# EAGLE design xo106-pth (EAGLE 7.7.0)
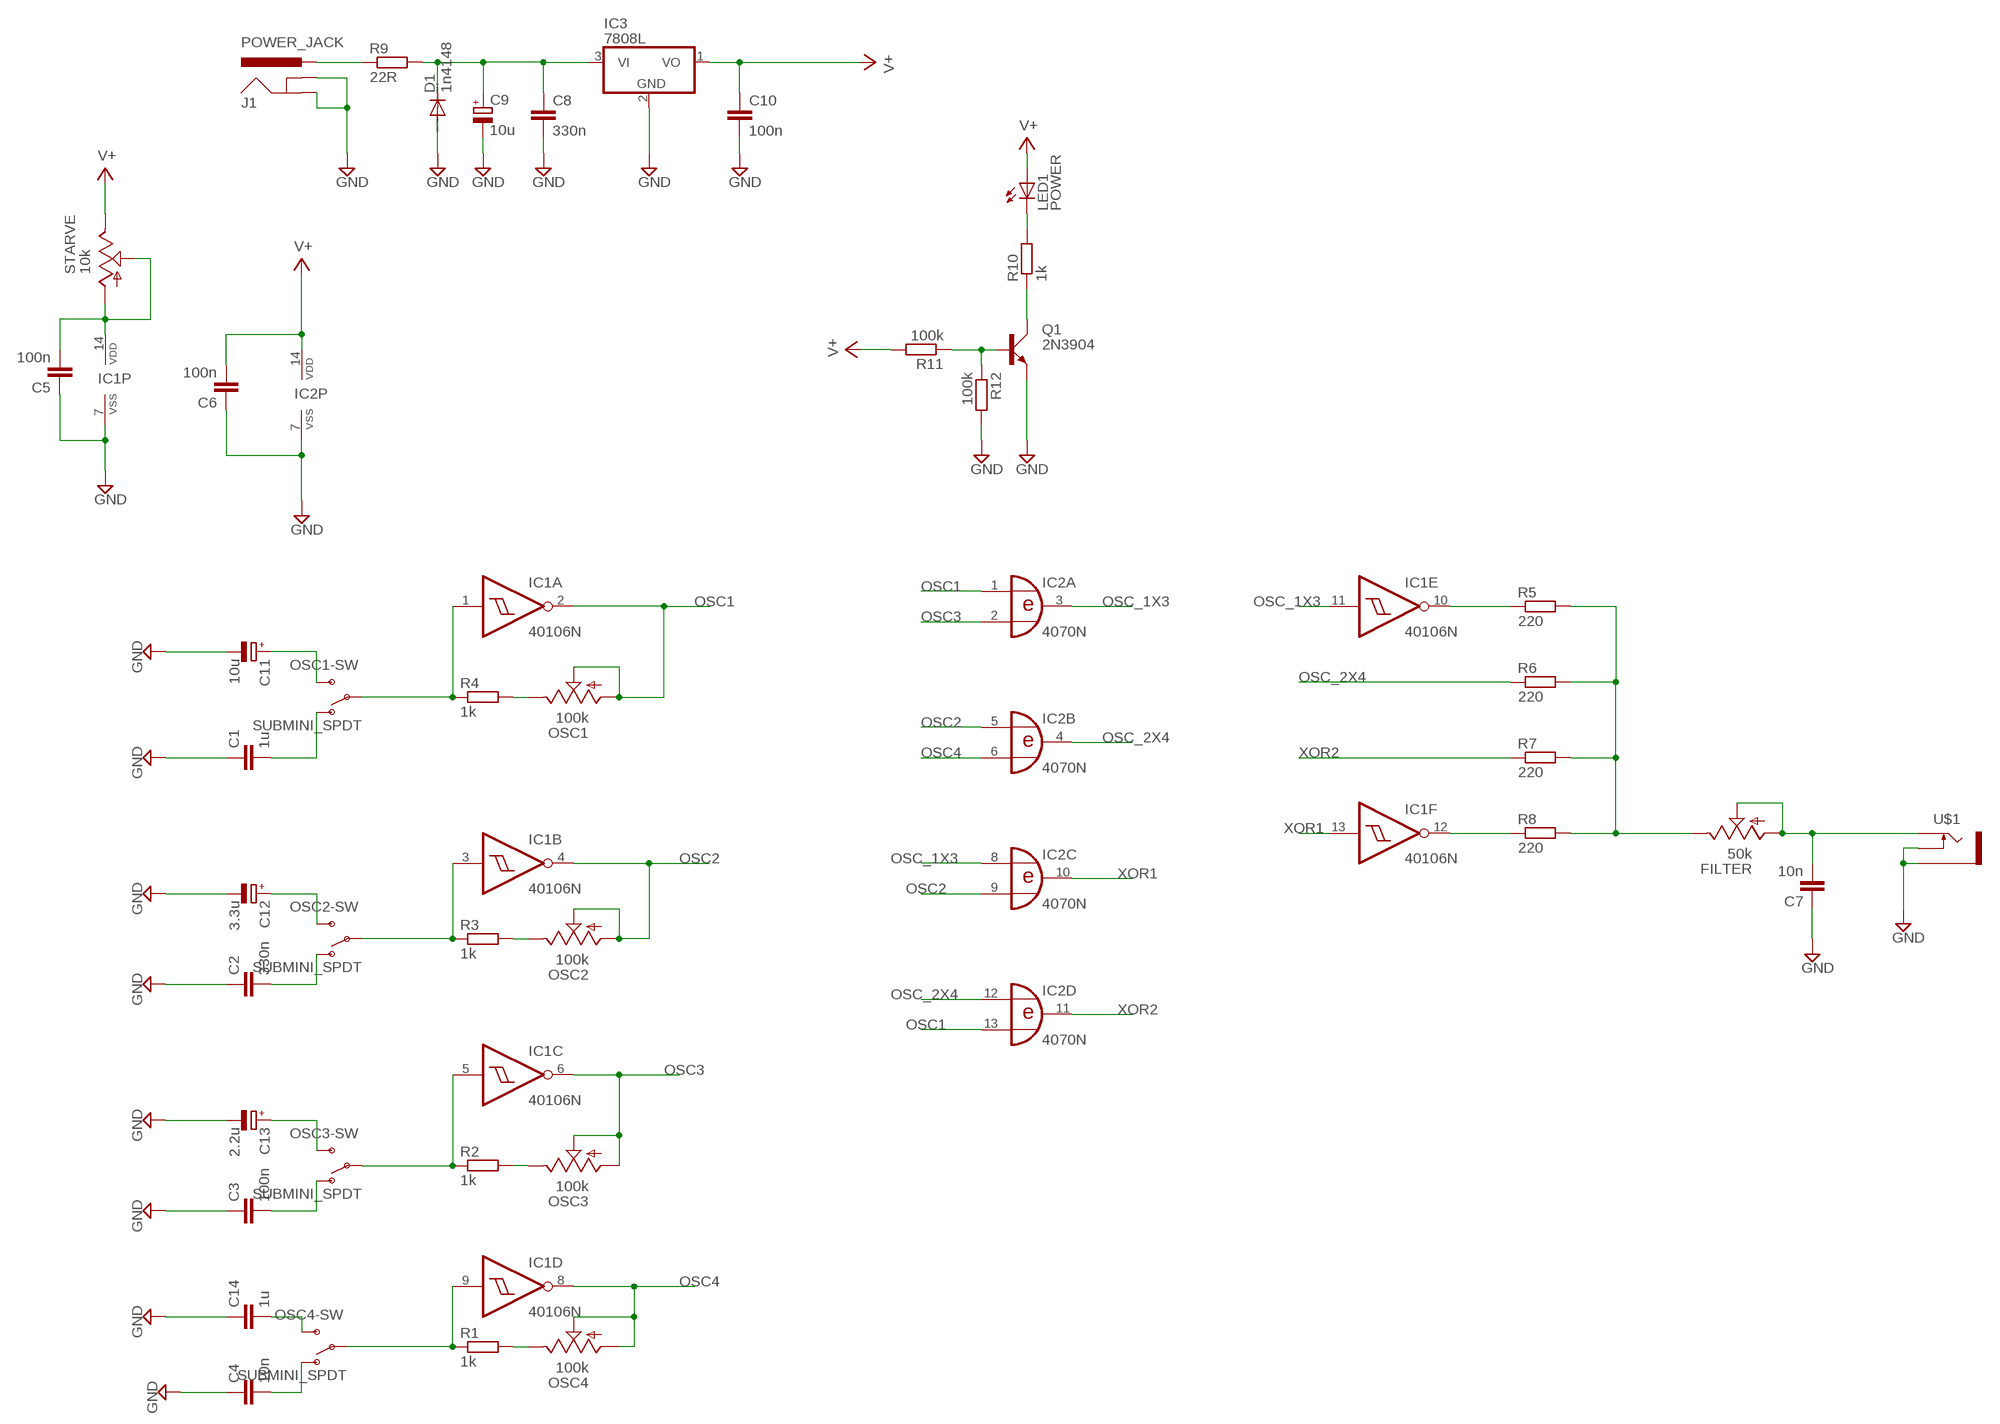
[diagram p0: schematic, sheet 1]

## Parts
C1  1u  C-EU050-025X075  [C050-025X075]
C2  330n  C-EU050-025X075  [C050-025X075]
C3  100n  C-EU050-025X075  [C050-025X075]
C4  10n  C-EU050-025X075  [C050-025X075]
C5  100n  C-EU025-025X050  [C025-025X050]
C6  100n  C-EU025-025X050  [C025-025X050]
C7  10n  C-EU050-025X075  [C050-025X075]
C8  330n  C-EU025-025X050  [C025-025X050]
C9  10u  CPOL-EUE2.5-5  [E2,5-5]
C10  100n  C-EU025-025X050  [C025-025X050]
C11  10u  CPOL-EUE2.5-5  [E2,5-5]
C12  3.3u  CPOL-EUE2.5-5  [E2,5-5]
C13  2.2u  CPOL-EUE2.5-5  [E2,5-5]
C14  1u  C-EU050-025X075  [C050-025X075]
D1  1n4148  DIODE-D-2.5  [D-2.5]
FILTER  50k  9MM_SNAP-IN_POT_  [9MM_SNAP-IN_POT]
IC1  40106N  [DIL14]
IC2  4070N  [DIL14]
IC3  7808L  [TO92]
J1  POWER_JACK  [POWER_JACK_PTH]
LED1  POWER  LED3MM  [LED3MM]
OSC1  100k  9MM_SNAP-IN_POT_  [9MM_SNAP-IN_POT]
OSC1-SW  SUBMINI_SPDT  [SUBMINI_TOGGLE]
OSC2  100k  9MM_SNAP-IN_POT_  [9MM_SNAP-IN_POT]
OSC2-SW  SUBMINI_SPDT  [SUBMINI_TOGGLE]
OSC3  100k  9MM_SNAP-IN_POT_  [9MM_SNAP-IN_POT]
OSC3-SW  SUBMINI_SPDT  [SUBMINI_TOGGLE]
OSC4  100k  9MM_SNAP-IN_POT_  [9MM_SNAP-IN_POT]
OSC4-SW  SUBMINI_SPDT  [SUBMINI_TOGGLE]
Q1  2N3904  [TO92D]
R1  1k  R-EU_0207/2V  [0207/2V]
R2  1k  R-EU_0207/2V  [0207/2V]
R3  1k  R-EU_0207/2V  [0207/2V]
R4  1k  R-EU_0207/2V  [0207/2V]
R5  220  R-EU_0207/2V  [0207/2V]
R6  220  R-EU_0207/2V  [0207/2V]
R7  220  R-EU_0207/2V  [0207/2V]
R8  220  R-EU_0207/2V  [0207/2V]
R9  22R  R-EU_0207/2V  [0207/2V]
R10  1k  R-EU_0207/2V  [0207/2V]
R11  100k  R-EU_0207/2V  [0207/2V]
R12  100k  R-EU_0207/2V  [0207/2V]
STARVE  10k  9MM_SNAP-IN_POT_  [9MM_SNAP-IN_POT]
U$1  PJ302M  [PJ302M]

## Nets
GND: C1.1 C2.1 C3.1 C4.1 C5.1 C6.1 C7.1 C8.2 C9.- C10.2 C11.- C12.- C13.- C14.1 D1.A IC1.7(P:VSS) IC2.7(P:VSS) IC3.2(GND) J1.GND J1.GNDBREAK Q1.E R12.2 U$1.GND(SLEEVE) U$1.SW(SWITCH)
N$1: IC1.3(B:I) OSC2-SW.COM(COMMON) R3.1
N$2: IC1.5(C:I) OSC3-SW.COM(COMMON) R2.1
N$3: IC1.1(A:I) OSC1-SW.COM(COMMON) R4.1
N$4: OSC1.3(E) R4.2
N$5: FILTER.3(E) R5.2 R6.2 R7.2 R8.2
N$6: OSC2.3(E) R3.2
N$7: C7.2 FILTER.1(A) FILTER.2(S) U$1.TIP
N$8: IC1.10(E:O) R5.1
N$9: OSC3.3(E) R2.2
N$10: IC1.9(D:I) OSC4-SW.COM(COMMON) R1.1
N$11: OSC4.3(E) R1.2
N$12: IC1.12(F:O) R8.1
N$13: C5.2 IC1.14(P:VDD) STARVE.1(A) STARVE.2(S)
N$14: C8.1 C9.+ D1.C IC3.3(VI) R9.2
N$15: C11.+ OSC1-SW.3(S)
N$16: C1.2 OSC1-SW.1(O)
N$17: Q1.B R11.1 R12.1
N$18: Q1.C R10.1
N$19: C12.+ OSC2-SW.3(S)
N$20: J1.PWR R9.1
N$21: C2.2 OSC2-SW.1(O)
N$22: LED1.K(C) R10.2
N$23: C13.+ OSC3-SW.3(S)
N$24: C3.2 OSC3-SW.1(O)
N$25: C4.2 OSC4-SW.1(O)
N$26: C14.2 OSC4-SW.3(S)
OSC1: IC1.2(A:O) IC2.1(A:I0) IC2.13(D:I1) OSC1.1(A) OSC1.2(S)
OSC2: IC1.4(B:O) IC2.5(B:I0) IC2.9(C:I1) OSC2.1(A) OSC2.2(S)
OSC3: IC1.6(C:O) IC2.2(A:I1) OSC3.1(A) OSC3.2(S)
OSC4: IC1.8(D:O) IC2.6(B:I1) OSC4.1(A) OSC4.2(S)
OSC_1X3: IC1.11(E:I) IC2.3(A:O) IC2.8(C:I0)
OSC_2X4: IC2.4(B:O) IC2.12(D:I0) R6.1
V+: C6.2 C10.1 IC2.14(P:VDD) IC3.1(VO) LED1.A R11.2 STARVE.3(E)
XOR1: IC1.13(F:I) IC2.10(C:O)
XOR2: IC2.11(D:O) R7.1

## Library data of the parts
C1-C8 C10 C14 = rcl:C-EU: CAPACITOR, European symbol
C9 C11-C13 = rcl:CPOL-EU: POLARIZED CAPACITOR, European symbol
D1 = diode:DIODE-: DIODE
FILTER OSC1-OSC4 STARVE = MusicThingModular:9MM_SNAP-IN_POT: 9mm vertical snap-in pot, Alpha / Panasonic style
IC1 = 40xx:40106: Hex SCHMITT TRIGGER
IC2 = 40xx:4070: Quad 2-input XOR
IC3 = linear:78*: Positive VOLTAGE REGULATOR Source: http://cache.national.com/ds/LM/LM78L05.pdf http://www.fairchildsemi.com/ds/LM/LM7805.pdf
J1 = SparkFun-Connectors:POWER_JACK: Power Jack Connector This is the standard 5.5mm barrel jack for power. The PTH is the most common, proven, reliable, footprint. The Slot footprint only works if the mill layer is transmitted to the PCB fab house so be warned. Here are the connectors we sell at SparkFun: DC Barrel Power Jack/Connector <https://www.sparkfun.com/products/119> (PRT-00119) DC Barrel Power Jack/Connector (SMD) <https://www.sparkfun.com/products/12748> (PRT-12748) DC Barrel Jack Adapter - Breadboard Compatible <https://www.sparkfun.com/products/10811> (PRT-10811) It is used on this SparkFun product (and many, many others): SparkFun RedBoard - Programmed with Arduino <https://www.sparkfun.com/products/12757> (DEV-12757) Also, if you need a mating power supply or connector, please check these out: Wall Adapter Power Supply - 9VDC 650mA <https://www.sparkfun.com/products/298> (TOL-00298) DC Barrel Jack Adapter - Male <https://www.sparkfun.com/products/10287> (PRT-10287); PROD_ID: CONN-08197
LED1 = led:LED: LED OSRAM: - CHIPLED LG R971, LG N971, LY N971, LG Q971, LY Q971, LO R971, LY R971 LH N974, LH R974 LS Q976, LO Q976, LY Q976 LO Q996 - Hyper CHIPLED LW Q18S LB Q993, LB Q99A, LB R99A - SideLED LS A670, LO A670, LY A670, LG A670, LP A670 LB A673, LV A673, LT A673, LW A673 LH A674 LY A675 LS A676, LA A676, LO A676, LY A676, LW A676 LS A679, LY A679, LG A679 - Hyper Micro SIDELED® LS Y876, LA Y876, LO Y876, LY Y876 LT Y87S - SmartLED LW L88C, LW L88S LB L89C, LB L89S, LG L890 LS L89K, LO L89K, LY L89K LS L896, LA L896, LO L896, LY L896 - TOPLED LS T670, LO T670, LY T670, LG T670, LP T670 LSG T670, LSP T670, LSY T670, LOP T670, LYG T670 LG T671, LOG T671, LSG T671 LB T673, LV T673, LT T673, LW T673 LH T674 LS T676, LA T676, LO T676, LY T676, LB T676, LH T676, LSB T676, LW T676 LB T67C, LV T67C, LT T67C, LS T67K, LO T67K, LY T67K, LW E67C LS E67B, LA E67B, LO E67B, LY E67B, LB E67C, LV E67C, LT E67C LW T67C LS T679, LY T679, LG T679 LS T770, LO T770, LY T770, LG T770, LP T770 LB T773, LV T773, LT T773, LW T773 LH T774 LS E675, LA E675, LY E675, LS T675 LS T776, LA T776, LO T776, LY T776, LB T776 LHGB T686 LT T68C, LB T68C - Hyper Mini TOPLED® LB M676 - Mini TOPLED Santana® LG M470 LS M47K, LO M47K, LY M47K Source: http://www.osram.convergy.de LUXEON: - LUMILED® LXK2-PW12-R00, LXK2-PW12-S00, LXK2-PW14-U00, LXK2-PW14-V00 LXK2-PM12-R00, LXK2-PM12-S00, LXK2-PM14-U00 LXK2-PE12-Q00, LXK2-PE12-R00, LXK2-PE12-S00, LXK2-PE14-T00, LXK2-PE14-U00 LXK2-PB12-K00, LXK2-PB12-L00, LXK2-PB12-M00, LXK2-PB14-N00, LXK2-PB14-P00, LXK2-PB14-Q00 LXK2-PR12-L00, LXK2-PR12-M00, LXK2-PR14-Q00, LXK2-PR14-R00 LXK2-PD12-Q00, LXK2-PD12-R00, LXK2-PD12-S00 LXK2-PH12-R00, LXK2-PH12-S00 LXK2-PL12-P00, LXK2-PL12-Q00, LXK2-PL12-R00 Source: www.luxeon.com KINGBRIGHT: KA-3528ASYC Source: www.kingbright.com
OSC1-SW OSC2-SW OSC3-SW OSC4-SW = MusicThingModular:SUBMINI_SPDT
Q1 = transistor-small-signal:2N3904: NPN TRANSISTOR
R1-R12 = rcl:R-EU_: RESISTOR, European symbol
U$1 = pj302m:PJ302M: PJ302M horizontal / right angled mount 3.5 mm jack socket

## Board
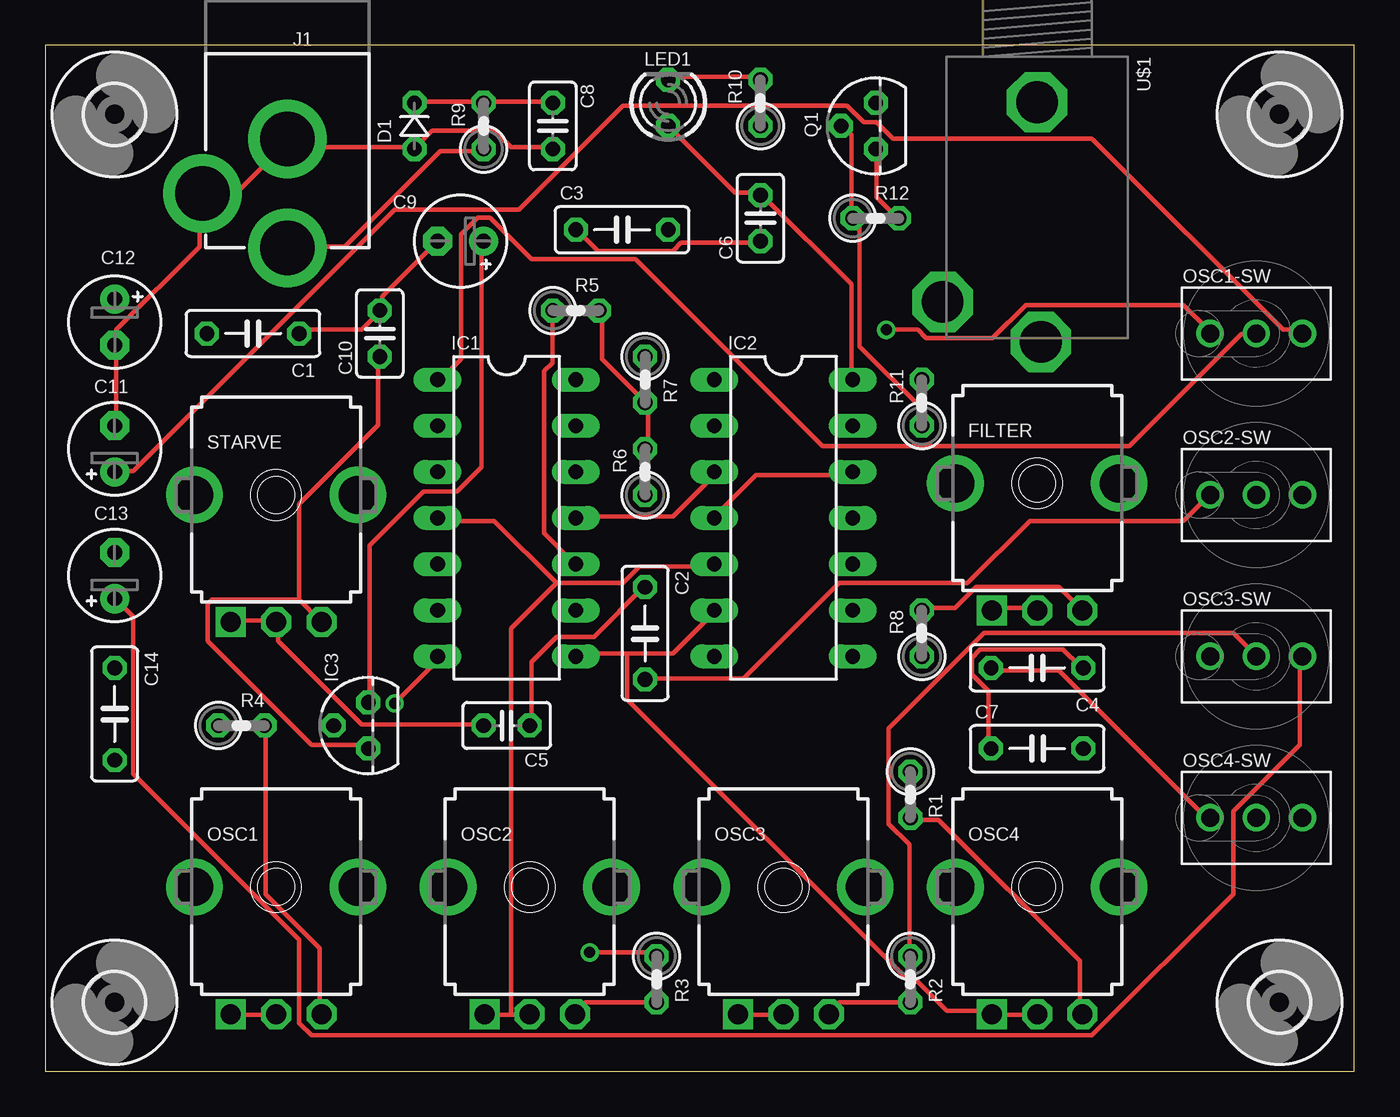
[diagram p1: board, top side]
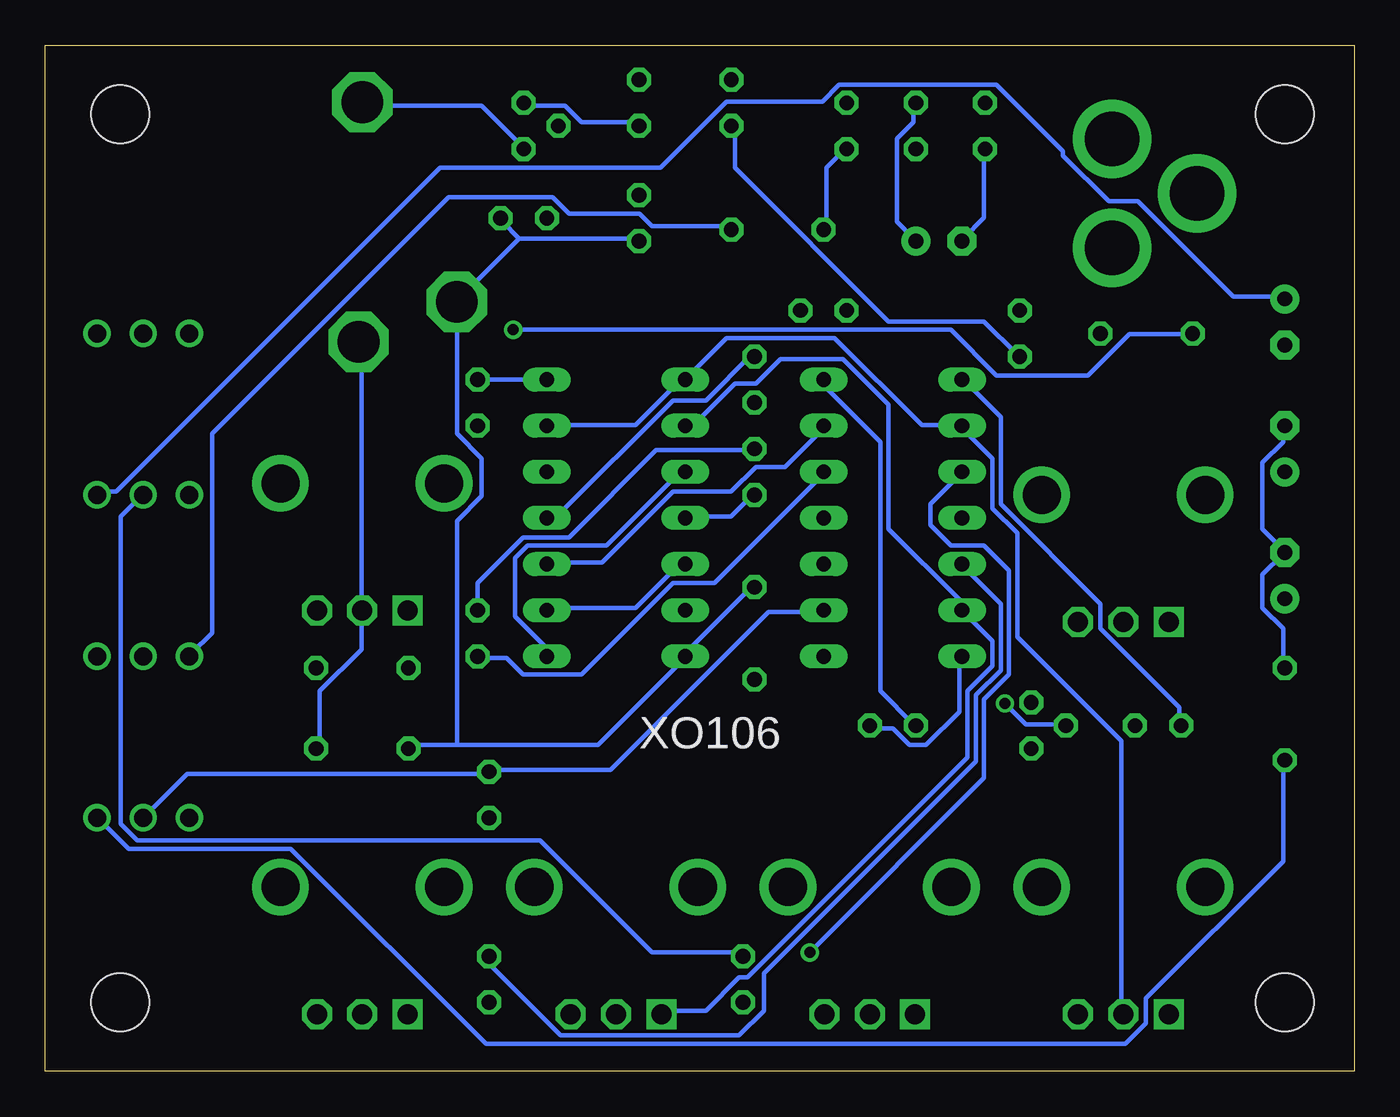
[diagram p2: board, bottom side, seen from below]

Size 72.06 x 56.51 mm. Coordinates in mm from the lower left corner, seen from the top.
Outline: 0,0 72.06,0 72.06,56.51 0,56.51 0,0
Copper layers (1*16): Top 0.035mm / dielectric 1.5mm / Bottom 0.035mm
Design rules "default": minimum track width 10mil, minimum drill 24mil, track to track 8mil, track to pad 8mil, pad to pad 8mil, via to via 8mil, smd to smd 8mil, copper to edge 40mil, drill to drill 8mil, minimum pad ring 10mil, minimum via ring 8mil, stop-mask expansion 4mil, vias tented up to drill 0mil, thermal gap 10mil

### Footprints (pad centres in the part's own frame; a part is rotated, then mirrored left to right if it is on the bottom)
C050-025X075 = drill 0.813 octagon: 1 -2.54,0; 2 2.54,0
C025-025X050 = drill 0.813 octagon: 1 -1.27,0; 2 1.27,0
E2,5-5 = drill 0.813 pad 1.6: + -1.27,0 | drill 0.813 pad 1.6 octagon: - 1.27,0
D-2.5 = drill 0.813 octagon: A 1.27,0; C -1.27,0
9MM_SNAP-IN_POT = drill 1.1 square: 1 -2.5,-7 | drill 1.1 octagon: 2 0,-7; 3 2.5,-7 | drill 2.1 pad 2.794: CHASSIS1 -4.5,0; CHASSIS2 4.5,0
DIL14 = drill 0.813 long: 1 -7.62,-3.81; 2 -5.08,-3.81; 3 -2.54,-3.81; 4 0,-3.81; 5 2.54,-3.81; 6 5.08,-3.81; 7 7.62,-3.81; 8 7.62,3.81; 9 5.08,3.81; 10 2.54,3.81; 11 0,3.81; 12 -2.54,3.81; 13 -5.08,3.81; 14 -7.62,3.81
TO92 = drill 0.813 octagon: 1 -1.27,0; 2 0,1.905; 3 1.27,0
POWER_JACK_PTH = drill 2.997 pad 4.318: GND 0,7.7; GNDBREAK 4.7,10.7; PWR 0,13.7
LED3MM = drill 0.813 octagon: A -1.27,0; K 1.27,0
SUBMINI_TOGGLE = drill 1 pad 1.422: 1 -2.54,0; 3 2.54,0; COM 0,0
TO92D = drill 0.813 octagon: B 0,1.905; C 1.27,0; E -1.27,0
0207/2V = drill 0.813 octagon: 1 -1.27,0; 2 1.27,0
PJ302M = drill 2.3 pad 3.3 octagon: GND 2.5,0; SW 13.5,-5.2; TIP 15.7,0.2
3,2 = hole 3.2: 0,0

### Placement (x,y rotation side)
C1  11.43,40.64 180 top
C2  33.02,24.13 270 top
C3  31.75,46.36 0 top
C4  54.61,22.22 180 top
C5  25.4,19.05 180 top
C6  39.37,46.99 90 top
C7  54.61,17.78 0 top
C8  27.94,52.07 270 top
C9  22.86,45.72 180 top
C10  18.41,40.64 90 top
C11  3.81,34.29 90 top
C12  3.81,41.28 270 top
C13  3.81,27.3 90 top
C14  3.81,19.68 270 top
D1  20.32,52.07 270 top
FILTER  54.61,32.39 0 top
IC1  25.4,30.48 270 top
IC2  40.64,30.48 270 top
IC3  17.78,19.05 90 top
J1  13.34,59.06 180 top
LED1  34.29,53.34 90 top
OSC1  12.7,10.16 0 top
OSC1-SW  66.68,40.64 0 top
OSC2  26.67,10.16 0 top
OSC2-SW  66.68,31.75 0 top
OSC3  40.64,10.16 0 top
OSC3-SW  66.68,22.86 0 top
OSC4  54.61,10.16 0 top
OSC4-SW  66.68,13.97 0 top
Q1  45.72,52.07 90 top
R1  47.62,15.24 270 top
R2  47.62,5.08 270 top
R3  33.66,5.08 270 top
R4  10.8,19.05 0 top
R5  29.21,41.91 0 top
R6  33.02,33.02 90 top
R7  33.02,38.1 270 top
R8  48.26,24.13 90 top
R9  24.13,52.07 90 top
R10  39.37,53.34 90 top
R11  48.26,36.83 90 top
R12  45.72,46.99 0 top
STARVE  12.7,31.75 0 top
U$1  54.61,55.88 270 top
U$6  [3,2]  3.81,52.7 0 top
U$7  [3,2]  67.95,52.7 0 top
U$8  [3,2]  67.95,3.81 0 top
U$9  [3,2]  3.81,3.81 0 top

### Tracks (layer width: path | path; a pad name or v marks a point on that pad's centre or on a via)
GND  (via drill 0.61)
  Top 0.254: C7.1 51.92,17.98 51.92,20.96 51,21.87 51,22.78 51.46,23.24 56.03,23.24 56.95,22.33 C4.1 | v19.23,20.27 21.74,22.78 IC1.7 | C2.1 32.94,26.67 30.2,23.93 28.14,23.93 26.77,22.55 26.77,19.13 C5.1 | Q1.E 45.74,50.67 45.74,48.16 46.89,47.02 R12.2 | C1.1 13.97,40.84 17.4,40.84 18.31,41.76 C10.2 18.54,41.99 18.54,42.67 C9.- | C8.2 27.91,50.9 25.63,50.9 24.71,51.82 21.29,51.82 20.37,50.9 D1.A 20.14,50.9 13.74,50.9 13.51,51.13 J1.GND 13.28,51.13 10.54,48.39 8.71,48.39 J1.GNDBREAK 8.48,48.16 8.48,45.42 3.91,40.84 3.91,40.16 C12.- 3.91,39.93 3.91,35.58 C11.- | C6.1 39.34,45.64 35,45.64 34.54,45.19 30.43,45.19 29.29,46.33 C3.1
  Bottom 0.254: C2.1 33.17,26.67 36.83,23.01 IC2.7 36.83,22.78 41.63,17.98 49.4,17.98 | v19.23,20.27 18.09,19.13 16.03,19.13 IC3.2 | C5.1 26.54,18.9 25.4,18.9 24.49,17.98 23.57,17.98 21.74,19.81 21.74,22.78 IC1.7 | 49.4,17.98 51.92,17.98 C7.1 | 45.97,45.87 39.57,45.87 C6.1 | 45.97,45.87 46.89,46.79 R12.2 | 45.97,45.87 49.4,42.44 U$1.SW 49.4,42.22 49.4,35.13 48.03,33.76 48.03,31.7 49.4,30.33 49.4,17.98 | U$1.GND 54.43,53.19 48.03,53.19 45.74,50.9 Q1.E | C3.1 29.06,46.56 29.06,49.76 28.14,50.67 C8.2 | D1.A 20.37,50.67 20.37,47.02 21.51,45.87 C9.- | C14.1 3.91,22.33 3.91,24.38 5.05,25.53 5.05,27.36 3.91,28.5 C13.- 3.91,28.73 5.05,29.87 5.05,33.53 3.91,34.67 3.91,35.36 C11.-
N$1  (via drill 0.61)
  Top 0.254: v29.97,6.55 33.63,6.55 R3.1
  Bottom 0.254: R3.1 33.86,6.55 38.66,6.55 44.83,12.72 67.01,12.72 67.92,13.64 67.92,30.56 66.78,31.7 OSC2-SW.COM | v29.97,6.55 20.37,16.15 20.37,20.5 19,21.87 19,27.58 20.37,28.96 22.2,28.96 23.34,30.1 23.34,31.24 21.74,32.84 IC1.3
N$2
  Top 0.254: R2.1 47.57,6.55 47.57,12.5 46.43,13.64 46.43,18.9 51.69,24.15 65.41,24.15 66.55,23.01 OSC3-SW.COM
  Bottom 0.254: IC1.5 21.51,27.81 19.46,25.76 19.46,22.1 20.83,20.73 20.83,17.07 32.49,5.41 32.49,3.35 33.86,1.98 43.69,1.98 47.57,5.87 47.57,6.32 R2.1
N$3
  Top 0.254: OSC1-SW.COM 66.55,40.61 65.86,40.61 59.69,34.44 42.77,34.44 32.49,44.73 26.77,44.73 24.49,47.02 23.8,47.02 22.88,46.1 22.88,39.24 21.74,38.1 IC1.1
  Bottom 0.254: R4.1 9.63,19.13 9.63,20.04 13.97,24.38 13.97,25.76 19.46,31.24 19.46,36.04 21.51,38.1 IC1.1
N$4
  Top 0.254: R4.2 12.14,18.9 12.14,9.75 15.11,6.78 15.11,3.35 OSC1.3
N$5
  Top 0.254: R6.2 33.17,34.44 33.17,36.73 R7.2 32.94,36.96 30.66,39.24 30.66,41.76 R5.2 | R8.2 48.26,25.53 50.09,25.53 51.23,26.67 55.8,26.67 56.95,25.53 FILTER.3
  Bottom 0.254: R8.2 48.26,26.9 45.74,29.41 43.23,29.41 38.43,34.21 33.17,34.21 R6.2
N$6
  Top 0.254: R3.2 29.74,3.81 29.29,3.35 OSC2.3
N$7
  Top 0.254: FILTER.1 52.15,25.53 54.43,25.53 FILTER.2
  Bottom 0.254: C7.2 56.95,17.98 56.95,20.96 54.66,23.24 54.66,25.3 FILTER.2 54.66,25.53 54.66,40.16 U$1.TIP
N$8
  Top 0.254: R5.1 27.91,41.76 27.91,39.01 27.46,38.56 27.46,29.64 29.06,28.04 IC1.10
N$9
  Top 0.254: R2.2 43.69,3.81 43.23,3.35 OSC3.3
N$10
  Bottom 0.254: OSC4-SW.COM 64.26,16.38 47.8,16.38 R1.1 47.57,16.61 40.95,16.61 32.26,25.3 29.29,25.3 IC1.9
N$11
  Top 0.254: R1.2 47.8,13.87 49.17,13.87 56.95,6.1 56.95,3.35 OSC4.3
N$12
  Bottom 0.254: R8.1 48.26,22.78 46.66,22.78 45.74,21.87 42.55,21.87 37.52,26.9 35.23,26.9 29.29,32.84 IC1.12
N$13
  Top 0.254: C5.2 24.03,19.13 17.4,19.13 12.83,23.7 12.83,24.61 STARVE.2 12.6,24.84 10.31,24.84 STARVE.1
  Bottom 0.254: IC1.14 29.06,38.1 29.06,37.64 26.09,34.67 26.09,20.96 24.26,19.13 C5.2
N$14
  Top 0.254: D1.C 20.37,53.42 24.03,53.42 R9.2 24.26,53.42 27.91,53.42 C8.1 | IC3.3 17.86,20.5 17.86,28.96 20.83,31.93 22.66,31.93 24.03,33.3 24.03,45.64 C9.+
  Bottom 0.254: R9.2 24.26,53.19 24.26,52.27 25.17,51.36 25.17,46.79 24.26,45.87 C9.+
N$15
  Top 0.254: OSC1-SW.3 69.06,40.84 68.15,40.84 57.63,51.36 46.66,51.36 45.74,52.27 45.06,52.27 44.14,53.19 31.8,53.19 26.09,47.47 19.23,47.47 4.83,33.07 3.91,33.07 C11.+
N$16  (via drill 0.61)
  Top 0.254: v46.3,40.84 48.03,40.84 48.49,40.39 52.15,40.39 53.98,42.22 62.66,42.22 64.03,40.84 OSC1-SW.1
  Bottom 0.254: v46.3,40.84 22.2,40.84 19.68,38.33 14.66,38.33 12.37,40.61 8.94,40.61 C1.2
N$17
  Top 0.254: Q1.B 43.92,52.05 44.37,51.59 44.37,47.02 R12.1 44.6,46.79 44.83,46.56 44.83,39.93 48.26,36.5 R11.1
N$18
  Bottom 0.254: R10.1 39.57,52.27 42.55,52.27 43.46,53.19 45.52,53.19 Q1.C
N$19
  Bottom 0.254: OSC2-SW.3 69.06,31.93 68.15,31.93 50.32,49.76 38.2,49.76 34.54,53.42 29.29,53.42 28.37,54.33 19.68,54.33 16.03,50.67 16.03,50.44 13.51,47.93 11.91,47.93 6.66,42.67 3.91,42.67 C12.+
N$20
  Top 0.254: R9.1 24.03,50.67 21.74,50.67 16.48,45.42 13.51,45.42 J1.PWR
N$21
  Top 0.254: C2.2 33.17,21.64 38.43,21.64 43.69,26.9 50.77,26.9 54.2,30.33 62.66,30.33 64.03,31.7 OSC2-SW.1
N$22
  Top 0.254: LED1.K 34.31,54.79 39.34,54.79 R10.2
N$23
  Top 0.254: OSC3-SW.3 69.06,22.78 69.06,17.98 65.41,14.33 65.41,9.75 57.63,1.98 14.66,1.98 13.97,2.67 13.97,7.24 4.83,16.38 4.83,25.07 3.91,25.98 C13.+
N$24
  Bottom 0.254: C3.2 34.31,46.56 38.66,46.56 39.34,47.24 43.23,47.24 44.14,48.16 49.86,48.16 62.89,35.13 62.89,24.15 64.03,23.01 OSC3-SW.1
N$25
  Top 0.254: C4.2 52.15,22.1 55.8,22.1 64.03,13.87 OSC4-SW.1
N$26
  Bottom 0.254: C14.2 3.91,17.07 3.91,11.58 11.45,4.04 11.45,2.67 12.6,1.52 47.8,1.52 58.55,12.27 67.46,12.27 69.06,13.87 OSC4-SW.3
OSC1
  Top 0.254: OSC1.1 10.31,3.12 12.6,3.12 OSC1.2
  Bottom 0.254: IC2.13 44.37,35.58 39.57,35.58 37.06,38.1 IC2.1 34.54,40.39 28.6,40.39 23.8,35.58 21.74,35.58 IC1.2 21.51,35.36 19.91,33.76 19.91,31.01 18.54,29.64 18.54,23.93 12.83,18.21 12.83,3.35 OSC1.2
OSC2
  Top 0.254: 25.63,3.12 26.54,3.12 OSC2.2 | 25.63,3.12 24.26,3.12 OSC2.1 | 28.14,26.9 24.71,30.33 21.74,30.33 IC1.4 | 28.14,26.9 31.8,26.9 32.72,27.81 36.83,27.81 IC2.5 | 25.63,3.12 25.63,24.38 28.14,26.9
  Bottom 0.254: IC2.9 44.37,25.53 39.57,25.53 37.29,27.81 36.83,27.81 IC2.5
OSC3
  Top 0.254: OSC3.1 38.2,3.12 40.49,3.12 OSC3.2
  Bottom 0.254: IC2.2 36.83,35.58 36.37,35.58 34.09,37.87 32.94,37.87 31.57,39.24 28.14,39.24 25.63,36.73 25.63,29.87 21.74,25.98 21.74,25.53 IC1.6 21.51,25.3 19.91,23.7 19.91,22.33 21.29,20.96 21.29,17.3 33.4,5.18 33.86,5.18 35.69,3.35 37.97,3.35 OSC3.1
OSC4
  Top 0.254: OSC4.2 54.43,3.12 52.15,3.12 OSC4.1 51.92,3.35 49.63,3.35 47.8,5.18 47.35,5.18 32.03,20.5 32.03,23.01 | 32.03,23.01 34.54,23.01 36.83,25.3 IC2.6 | 32.03,23.01 29.29,23.01 IC1.8
OSC_1X3
  Top 0.254: IC1.11 29.29,30.56 34.54,30.56 36.83,32.84 IC2.3
  Bottom 0.254: IC2.8 44.6,23.01 44.6,23.47 46.2,25.07 46.2,28.27 45.52,28.96 41.17,28.96 37.29,32.84 36.83,32.84 IC2.3
OSC_2X4
  Top 0.254: IC2.12 44.37,32.84 39.12,32.84 36.83,30.56 IC2.4
  Bottom 0.254: IC2.4 36.83,30.56 34.31,30.56 33.17,31.7 R6.1
V+
  Top 0.254: LED1.A 37.97,48.39 39.34,48.39 C6.2 39.57,48.16 44.37,43.36 44.37,38.1 IC2.14 | 13.97,25.98 9.17,25.98 8.94,25.76 8.94,23.7 14.66,17.98 17.63,17.98 IC3.1 | 13.97,25.98 15.11,24.84 STARVE.3 | 13.97,25.98 13.97,31.24 18.31,35.58 18.31,39.24 C10.1
  Bottom 0.254: R11.2 IC2.14 | LED1.A 34.09,52.05 34.09,49.76 25.63,41.3 20.37,41.3 18.54,39.47 C10.1
XOR1
  Bottom 0.254: IC2.10 44.37,28.04 41.4,28.04 37.52,31.93 34.31,31.93 32.94,33.3 31.34,33.3 29.29,35.36 IC1.13
XOR2
  Bottom 0.254: IC2.11 44.37,30.56 43.92,30.56 37.52,36.96 35.69,36.96 33.17,39.47 R7.1

### Text on the board
bNames: XO106